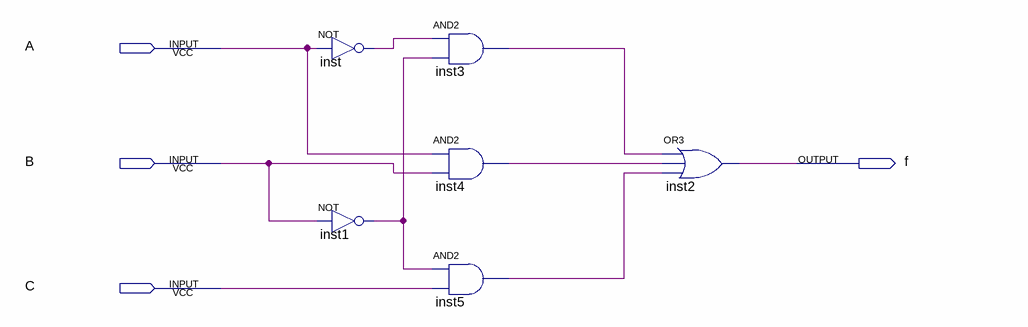
[diagram p0: schematic sheet]
// Quartus schematic f_E3.bdf as structural Verilog: 6 symbols, 4 pins
module f_E3 (
  input  A,
  input  B,
  input  C,
  output f
);

  wire inst1_out, inst3_out, inst4_out, inst5_out, inst_out;

  not inst (inst_out, A);
  not inst1 (inst1_out, B);
  and inst3 (inst3_out, inst_out, inst1_out);
  and inst4 (inst4_out, A, B);
  and inst5 (inst5_out, inst1_out, C);
  or inst2 (f, inst3_out, inst4_out, inst5_out);
endmodule
